# Altium schematic sheet JPEG_Decoder.SchDoc
size A; DocumentNumber: 1; SheetNumber: 1; SheetTotal: 1
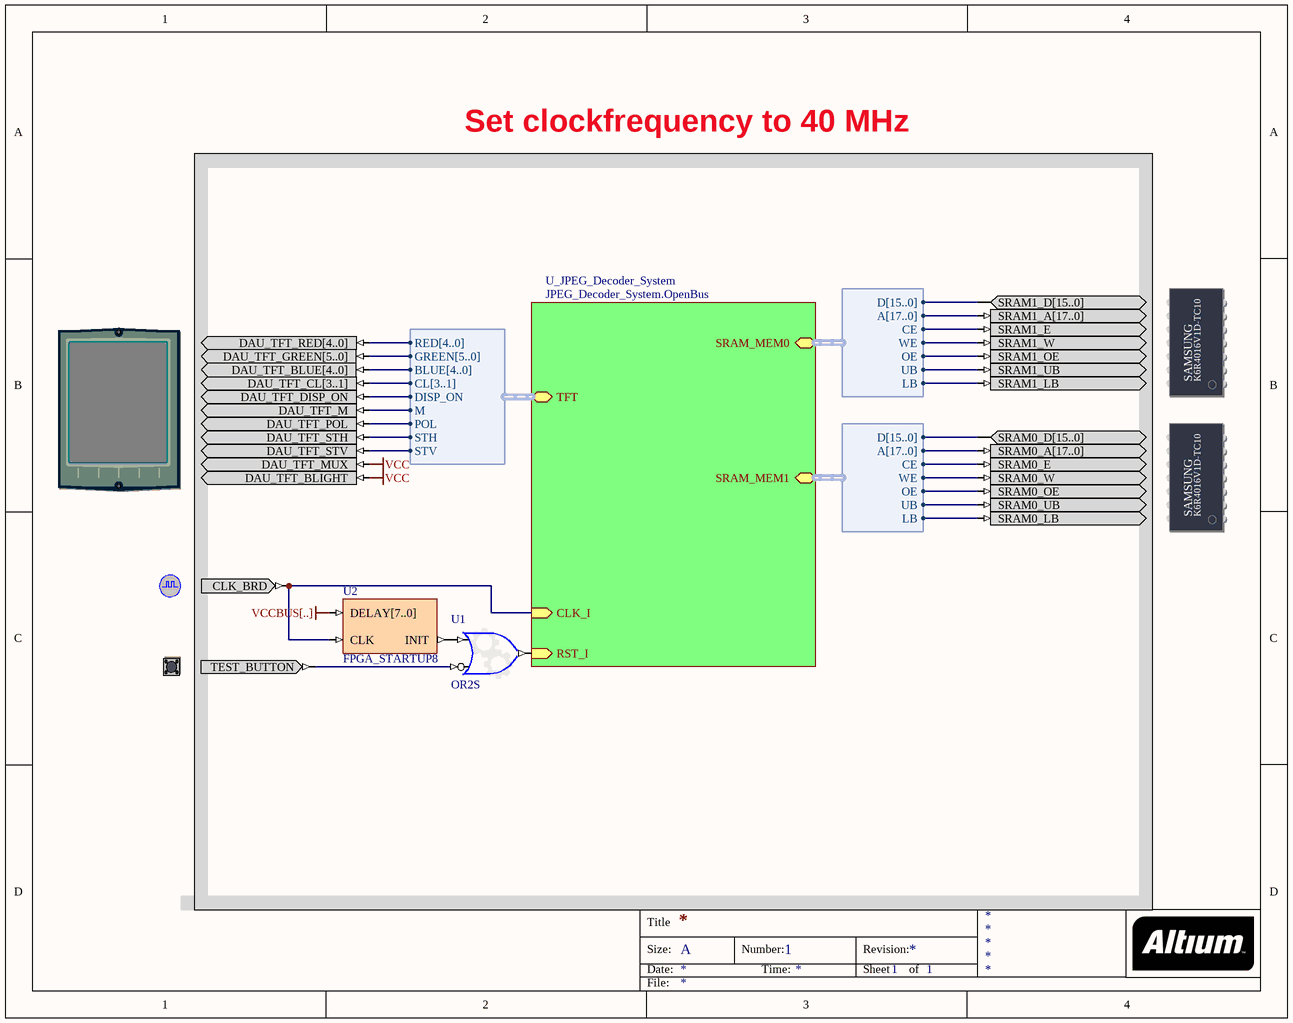
[diagram p0: JPEG_Decoder.SchDoc]

## Parts
(Parts that share a designator on the sheet are numbered #1, #2 ... from top to bottom, then left to right.)
?#1  SRAM_DAUGHTER1  (value not drawn)
?#2  TFT_LCD  (value not drawn)
?#3  SRAM_DAUGHTER0  (value not drawn)
?#4  CLOCK_BOARD  (value not drawn)
?#5  TEST_BUTTON  (value not drawn)
U1  OR2S
U2  FPGA_STARTUP8

## Blocks framed on the sheet
Set clockfrequency to 40 MHz: ?#1-?#5 U1 U2

## Sub-sheets
U_JPEG_Decoder_System = JPEG_Decoder_System.OpenBus: RST_I (in), CLK_I (in), SRAM_MEM0 (harness WB_MEM_CTRL_SRAM16_A18), SRAM_MEM1 (harness WB_MEM_CTRL_SRAM16_A18), TFT (harness VGA32_TFT)

## Harnesses
WB_MEM_CTRL_SRAM16_A18: D[15..0], A[17..0], CE, WE, OE, UB, LB
VGA32_TFT: RED[4..0], GREEN[5..0], BLUE[4..0], CL[3..1], DISP_ON, M, POL, STH, STV

## Nets
VCC: ?#2.DAU_TFT_BLIGHT ?#2.DAU_TFT_MUX
VCCBUS[..]: U2.DELAY[7..0]
Net?#1_SRAM1_A[17..0]: ?#1.SRAM1_A[17..0] ; sheet U_JPEG_Decoder_System/SRAM_MEM0.A[17..0]
Net?#1_SRAM1_D[15..0]: ?#1.SRAM1_D[15..0] ; sheet U_JPEG_Decoder_System/SRAM_MEM0.D[15..0]
Net?#1_SRAM1_E: ?#1.SRAM1_E ; sheet U_JPEG_Decoder_System/SRAM_MEM0.CE
Net?#1_SRAM1_LB: ?#1.SRAM1_LB ; sheet U_JPEG_Decoder_System/SRAM_MEM0.LB
Net?#1_SRAM1_OE: ?#1.SRAM1_OE ; sheet U_JPEG_Decoder_System/SRAM_MEM0.OE
Net?#1_SRAM1_UB: ?#1.SRAM1_UB ; sheet U_JPEG_Decoder_System/SRAM_MEM0.UB
Net?#1_SRAM1_W: ?#1.SRAM1_W ; sheet U_JPEG_Decoder_System/SRAM_MEM0.WE
Net?#2_DAU_TFT_BLUE[4..0]: ?#2.DAU_TFT_BLUE[4..0] ; sheet U_JPEG_Decoder_System/TFT.BLUE[4..0]
Net?#2_DAU_TFT_CL[3..1]: ?#2.DAU_TFT_CL[3..1] ; sheet U_JPEG_Decoder_System/TFT.CL[3..1]
Net?#2_DAU_TFT_DISP_ON: ?#2.DAU_TFT_DISP_ON ; sheet U_JPEG_Decoder_System/TFT.DISP_ON
Net?#2_DAU_TFT_GREEN[5..0]: ?#2.DAU_TFT_GREEN[5..0] ; sheet U_JPEG_Decoder_System/TFT.GREEN[5..0]
Net?#2_DAU_TFT_M: ?#2.DAU_TFT_M ; sheet U_JPEG_Decoder_System/TFT.M
Net?#2_DAU_TFT_POL: ?#2.DAU_TFT_POL ; sheet U_JPEG_Decoder_System/TFT.POL
Net?#2_DAU_TFT_RED[4..0]: ?#2.DAU_TFT_RED[4..0] ; sheet U_JPEG_Decoder_System/TFT.RED[4..0]
Net?#2_DAU_TFT_STH: ?#2.DAU_TFT_STH ; sheet U_JPEG_Decoder_System/TFT.STH
Net?#2_DAU_TFT_STV: ?#2.DAU_TFT_STV ; sheet U_JPEG_Decoder_System/TFT.STV
Net?#3_SRAM0_A[17..0]: ?#3.SRAM0_A[17..0] ; sheet U_JPEG_Decoder_System/SRAM_MEM1.A[17..0]
Net?#3_SRAM0_D[15..0]: ?#3.SRAM0_D[15..0] ; sheet U_JPEG_Decoder_System/SRAM_MEM1.D[15..0]
Net?#3_SRAM0_E: ?#3.SRAM0_E ; sheet U_JPEG_Decoder_System/SRAM_MEM1.CE
Net?#3_SRAM0_LB: ?#3.SRAM0_LB ; sheet U_JPEG_Decoder_System/SRAM_MEM1.LB
Net?#3_SRAM0_OE: ?#3.SRAM0_OE ; sheet U_JPEG_Decoder_System/SRAM_MEM1.OE
Net?#3_SRAM0_UB: ?#3.SRAM0_UB ; sheet U_JPEG_Decoder_System/SRAM_MEM1.UB
Net?#3_SRAM0_W: ?#3.SRAM0_W ; sheet U_JPEG_Decoder_System/SRAM_MEM1.WE
Net?#4_CLK_BRD: ?#4.CLK_BRD U2.CLK ; sheet U_JPEG_Decoder_System/CLK_I
Net?#5_TEST_BUTTON: ?#5.TEST_BUTTON U1.I1
NetU1_I0: U1.I0 U2.INIT
NetU1_O: U1.O ; sheet U_JPEG_Decoder_System/RST_I

## Notes on the sheet
- Title
- Size:
- Date:
- A
- Number:
- Time:
- Revision:
- Sheet
- of
- File:
- (in symbol SRAM_DAUGHTER0) SAMSUNG; K6R4016V1D-TC10
- (in symbol SRAM_DAUGHTER1) SAMSUNG; K6R4016V1D-TC10

## Library data of the parts
?#1 = SRAM_DAUGHTER1: Free Static RAM - Daughterboard; PortComponent: True; Published: 14-May-2007; Publisher: Altium Limited; HelpURL: TR0143 NanoBoard Technical Reference Manual - NB2.pdf#page=24
?#2 = TFT_LCD: TFT LCD Panel; PortComponent: True; Published: 22-Jan-2007; Publisher: Altium Limited; HelpURL: TR0143 Technical Reference Manual for Altium's Desktop NanoBoard NB2DSK01.pdf#page=50
?#3 = SRAM_DAUGHTER0: Free Static RAM - Daughterboard; PortComponent: True; Published: 14-May-2007; Publisher: Altium Limited; HelpURL: TR0143 NanoBoard Technical Reference Manual - NB2.pdf#page=24
?#4 = CLOCK_BOARD: Global System Clock Supply; PortComponent: True; Published: 19-Nov-2003; Publisher: Altium Limited; HelpURL: TR0143 Technical Reference Manual for Altium's Desktop NanoBoard NB2DSK01.pdf#page=41; UseInDSF: True
?#5 = TEST_BUTTON: Test / Reset Button; PortComponent: True; Published: 19-Nov-2003; Publisher: Altium Limited; HelpURL: TR0143 Technical Reference Manual for Altium's Desktop NanoBoard NB2DSK01.pdf#page=53
U1 = GATE: Configurable Generic Gate; ConfiguratorName: GENERIC_GATE; ConfigurationParameters: {}Version[1.0]{}GateKind[OR]{}BusInput[False]{}GateInputType[Bit]{}GateOutputOption[Normal]{}BusWidth[8]{}RegisterOutputs[False]{}NegativeClockEdge[False]{}InputCount[2]{}InputInvert0[False]{}InputInvert1[True]{}; LastRevisionNo: 1.00.00; Published: 3-Sep-2008; Publisher: Altium Limited
U2 = FPGA_STARTUP8: FPGA Startup With 8 Bit Delay; Published: 9-Dec-2004; Publisher: Altium Limited; HelpURL: CR0119 FPGA_STARTUPx Powerup Delay Unit.pdf; LastRevisionNo: 1.00.00; ComponentLink1Description: Core &Resource Usage; ComponentLink1URL: CR0139 FPGA Peripheral Resource Usage.pdf#page=11